# Altium schematic sheet eFuse.SchDoc
size A; SheetNumber: 7; SheetTotal: 10
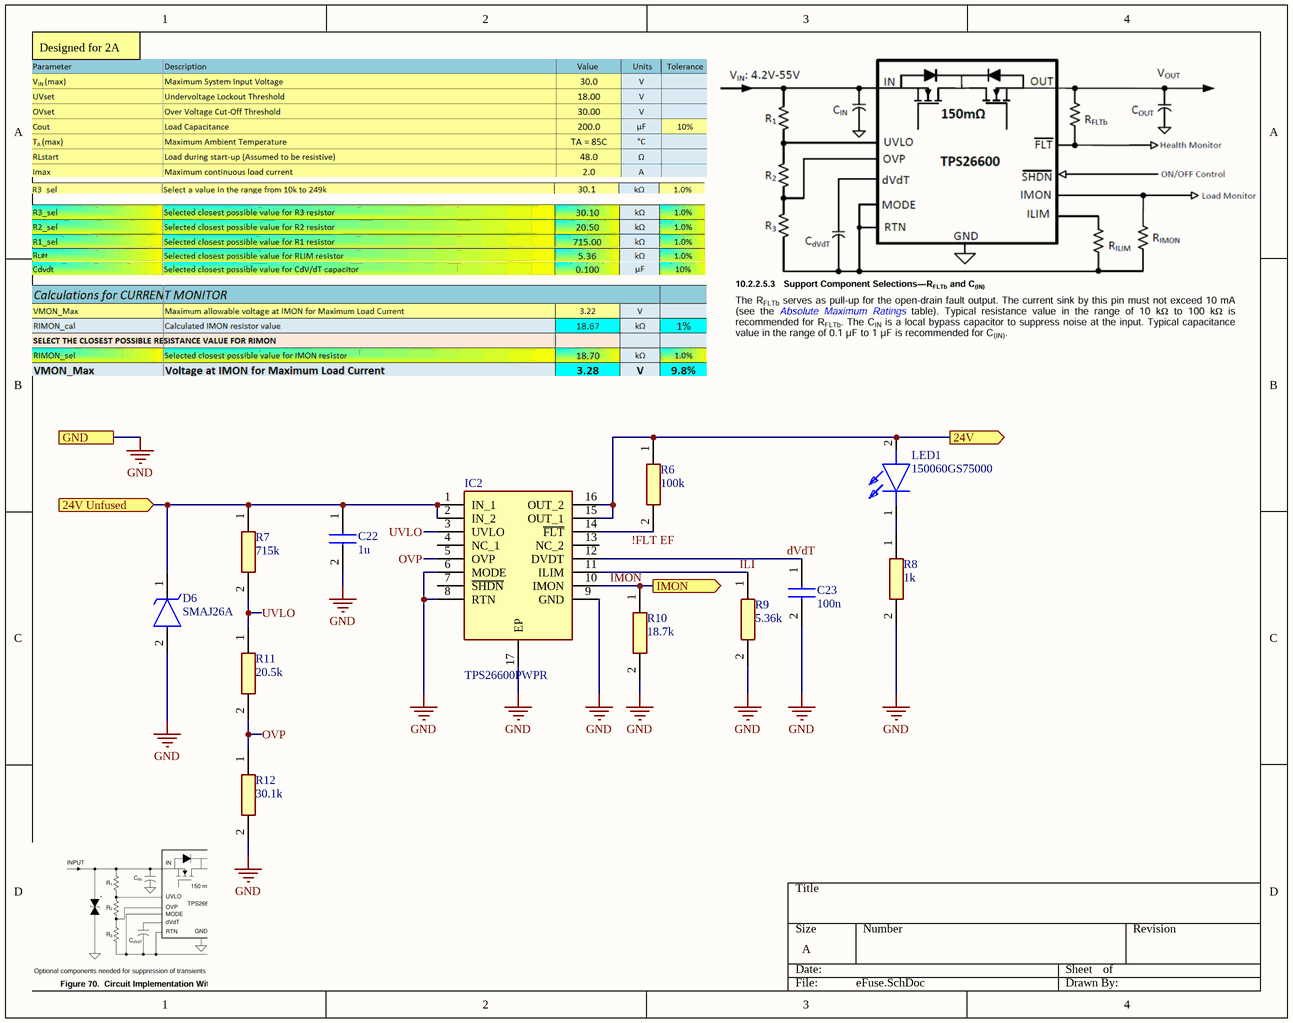
[diagram p0: eFuse.SchDoc]

## Parts
C22  1u  [CAPC1608X95N]
C23  100n  [CAPC1608X90N]
D6  SMAJ26A  [DIOM5026X229N]
IC2  TPS26600PWPR  [SOP65P640X120-17N]
LED1  150060GS75000  [LEDC1608X70N]
R6  100k  [RESC1608X55N]
R7  715k  [RESC1608X55N]
R8  1k  [RESC1608X55N]
R9  5.36k  [RESC1608X55N]
R10  18.7k  [RESC1608X55N]
R11  20.5k  [RESC1608X55N]
R12  30.1k  [ERJH3]

## Ports
24V (out), 24V Unfused (in), GND, IMON (out)

## Nets
GND: C22.2 C23.2 D6.2(A) IC2.6(MODE) IC2.8(RTN) IC2.9(GND) IC2.17(EP) R8.2 R9.2 R10.2 R12.2 ; port GND
24V: IC2.15(OUT_1) IC2.16(OUT_2) LED1.2(A) R6.1 ; port 24V
24V Unfused: C22.1 D6.1(K) IC2.1(IN_1) IC2.2(IN_2) R7.1 ; port 24V Unfused
!FLT EF: IC2.14(~{FLT}) R6.2
dVdT: C23.1 IC2.12(DVDT)
ILI: IC2.11(ILIM) R9.1
IMON: IC2.10(IMON) R10.1 ; port IMON
OVP: IC2.5(OVP) R11.2 R12.1
UVLO: IC2.3(UVLO) R7.2 R11.1
NetLED1_1: LED1.1(K) R8.1

Not connected (* = marked no-connect by the designer): IC2 4(NC_1) 7(~{SHDN}) 13(NC_2)

## Notes on the sheet
- Designed for 2A

## Library data of the parts
C22 = UMK107AB7105KA-T: Capacitor; Manufacturer_Name: TAIYO YUDEN; Datasheet Link: https://ds.yuden.co.jp/TYCOMPAS/or/detail?pn=UMK107AB7105KA-T&u=M; Height: 0.95mm; Manufacturer_Part_Number: UMK107AB7105KA-T; Mouser Part Number: 963-UMK107AB7105KA-T; Mouser Price/Stock: https://www.mouser.co.uk/ProductDetail/TAIYO-YUDEN/UMK107AB7105KA-T?qs=%252BAZVS4b%2FkgKLk%2FvFAZMoRQ%3D%3D; Arrow Part Number: UMK107AB7105KA-T; Arrow Price/Stock: https://www.arrow.com/en/products/umk107ab7105ka-t/taiyo-yuden?utm_currency=USD&region=nac
C23 = 06035C104J4Z2A: Capacitor; Manufacturer_Name: Kyocera AVX; Datasheet Link: https://componentsearchengine.com/Datasheets/1/06031A100FAT2A.pdf; Height: 0.9mm; Manufacturer_Part_Number: 06035C104J4Z2A; Mouser Part Number: 581-06035C104J4Z2A; Mouser Price/Stock: https://www.mouser.co.uk/ProductDetail/KYOCERA-AVX/06035C104J4Z2A?qs=Awwwc1gvTnlncvTGCFZvkw%3D%3D; Arrow Part Number: 06035C104J4Z2A; Arrow Price/Stock: https://www.arrow.com/en/products/06035c104j4z2a/avx
D6 = SMAJ26A: TVS Diode (Uni-directional); Manufacturer_Name: LITTELFUSE; Datasheet Link: https://www.littelfuse.com/~/media/electronics/datasheets/tvs_diodes/littelfuse_tvs_diode_smaj_datasheet.pdf.pdf; Height: 2.29mm; Manufacturer_Part_Number: SMAJ26A; Mouser Part Number: 576-SMAJ26A; Mouser Price/Stock: https://www.mouser.co.uk/ProductDetail/Littelfuse/SMAJ26A?qs=HR2RnyOI4E5UFOxZR4oQ3w%3D%3D; Arrow Part Number: SMAJ26A; Arrow Price/Stock: https://www.arrow.com/en/products/smaj26a/littelfuse?region=nac
IC2 = TPS26600PWPR: Integrated Circuit; Manufacturer_Name: Texas Instruments; Datasheet Link: http://www.ti.com/lit/gpn/tps2660; Height: 1.2mm; Manufacturer_Part_Number: TPS26600PWPR; Mouser Part Number: 595-TPS26600PWPR; Mouser Price/Stock: https://www.mouser.co.uk/ProductDetail/Texas-Instruments/TPS26600PWPR?qs=Bho%2FbeBaDExFVQBFO8fB%2FQ%3D%3D; Arrow Part Number: TPS26600PWPR; Arrow Price/Stock: https://www.arrow.com/en/products/tps26600pwpr/texas-instruments?region=nac
LED1 = 150060GS75000: LED; Manufacturer_Name: Wurth Elektronik; Datasheet Link: https://www.we-online.com/catalog/datasheet/150060GS75000.pdf; Height: 0.7mm; Manufacturer_Part_Number: 150060GS75000; Mouser Part Number: 710-150060GS75000; Mouser Price/Stock: https://www.mouser.co.uk/ProductDetail/Wurth-Elektronik/150060GS75000?qs=LlUlMxKIyB0UYkq5lDO8nA%3D%3D
R6 = CR0603-JW-104ELF: Resistor; Manufacturer_Name: Bourns; Datasheet Link: https://www.bourns.com/pdfs/chpreztr.pdf; Height: 0.55mm; Manufacturer_Part_Number: CR0603-JW-104ELF; Mouser Part Number: 652-CR0603-JW-104ELF; Mouser Price/Stock: https://www.mouser.co.uk/ProductDetail/Bourns/CR0603-JW-104ELF?qs=wOX%252BDVkMoZSK2gq9cFrtRg%3D%3D; Arrow Part Number: CR0603-JW-104ELF; Arrow Price/Stock: https://www.arrow.com/en/products/cr0603-jw-104elf/bourns?region=nac
R7 = ERJ-3RED7153V: Resistor; Manufacturer_Name: Panasonic; Height: 0.55mm; Manufacturer_Part_Number: ERJ-3RED7153V; Mouser Part Number: 667-ERJ-3RED7153V; Mouser Price/Stock: https://www.mouser.co.uk/ProductDetail/Panasonic/ERJ-3RED7153V?qs=KTDjhDDUMAkeRZjDK2%2FIGQ%3D%3D
R8 = RMCF0603JT1K00: Resistor; Manufacturer_Name: Stackpole Electronics; Datasheet Link: https://www.seielect.com/Catalog/SEI-RMCF_RMCP.pdf; Height: 0.55mm; Manufacturer_Part_Number: RMCF0603JT1K00; Mouser Part Number: 708-RMCF0603JT1K00; Mouser Price/Stock: https://www.mouser.co.uk/ProductDetail/SEI-Stackpole/RMCF0603JT1K00?qs=FESYatJ8odK3lrUeqnFxyg%3D%3D; Arrow Part Number: RMCF0603JT1K00; Arrow Price/Stock: https://www.arrow.com/en/products/rmcf0603jt1k00/stackpole-electronics?region=nac
R9 = RK73H1JTTD5361F: Resistor; Manufacturer_Name: KOA Speer; Datasheet Link: http://www.koaspeer.com/catimages/Products/RK73-RT/RK73-RT.pdf; Height: 0.55mm; Manufacturer_Part_Number: RK73H1JTTD5361F; Mouser Part Number: 660-RK73H1JTTD5361F; Mouser Price/Stock: http://www.mouser.com/Search/ProductDetail.aspx?qs=VsVuNjgfZhozLTQBmeIWog%3d%3d
R10 = RMCF0603FT18K7: Resistor; Manufacturer_Name: Stackpole Electronics; Datasheet Link: https://www.seielect.com/Catalog/SEI-RMCF_RMCP.pdf; Height: 0.55mm; Manufacturer_Part_Number: RMCF0603FT18K7
R11 = ERJ-3EKF2052V: Resistor; Manufacturer_Name: Panasonic; Datasheet Link: http://industrial.panasonic.com/cdbs/www-data/pdf/RDA0000/AOA0000C86.pdf; Height: 0.55mm; Manufacturer_Part_Number: ERJ-3EKF2052V; Arrow Part Number: ERJ-3EKF2052V; Arrow Price/Stock: https://www.arrow.com/en/products/erj3ekf2052v/panasonic?region=nac
R12 = ERJ-H3EF3012V: Resistor; Manufacturer_Name: Panasonic; Datasheet Link: http://industrial.panasonic.com/cdbs/www-data/pdf/RDQ0000/ast-ind-151033.pdf; Manufacturer_Part_Number: ERJ-H3EF3012V